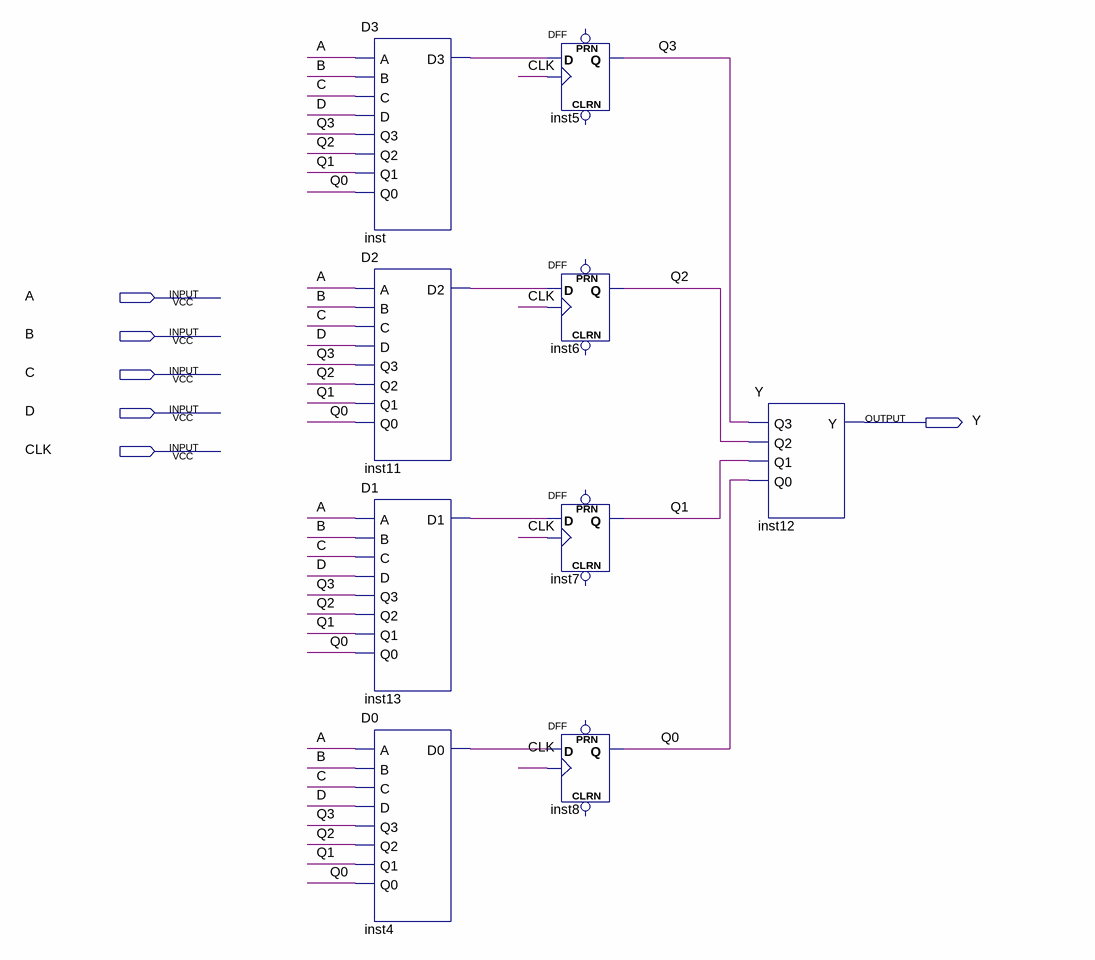
[diagram p0: schematic sheet]
// Quartus schematic MSSVxacdinh.bdf as structural Verilog: 9 symbols, 6 pins
module MSSVxacdinh (
  input  A,
  input  B,
  input  C,
  input  D,
  input  CLK,
  output Y
);

  wire inst4_d0, inst11_d2, inst13_d1, inst_d3, Q0, Q1, Q2, Q3;

  D3 inst (.A(A), .B(B), .C(C), .D(D), .Q3(Q3), .Q2(Q2), .Q1(Q1), .Q0(Q0), .D3(inst_d3));
  D2 inst11 (.A(A), .B(B), .C(C), .D(D), .Q3(Q3), .Q2(Q2), .Q1(Q1), .Q0(Q0), .D2(inst11_d2));
  D1 inst13 (.A(A), .B(B), .C(C), .D(D), .Q3(Q3), .Q2(Q2), .Q1(Q1), .Q0(Q0), .D1(inst13_d1));
  D0 inst4 (.A(A), .B(B), .C(C), .D(D), .Q3(Q3), .Q2(Q2), .Q1(Q1), .Q0(Q0), .D0(inst4_d0));
  DFF inst5 (.CLK(CLK), .D(inst_d3), .Q(Q3));  // open: CLRN, PRN
  DFF inst6 (.CLK(CLK), .D(inst11_d2), .Q(Q2));  // open: CLRN, PRN
  DFF inst7 (.CLK(CLK), .D(inst13_d1), .Q(Q1));  // open: CLRN, PRN
  DFF inst8 (.CLK(CLK), .D(inst4_d0), .Q(Q0));  // open: CLRN, PRN
  Y inst12 (.Q3(Q3), .Q2(Q2), .Q1(Q1), .Q0(Q0), .Y(Y));
endmodule
